# EAGLE design LIC_rack_OV-01 (EAGLE 5.06)
AUTHOR: M. Petrilak; VERSION: 01

## Sheet 1 of 2
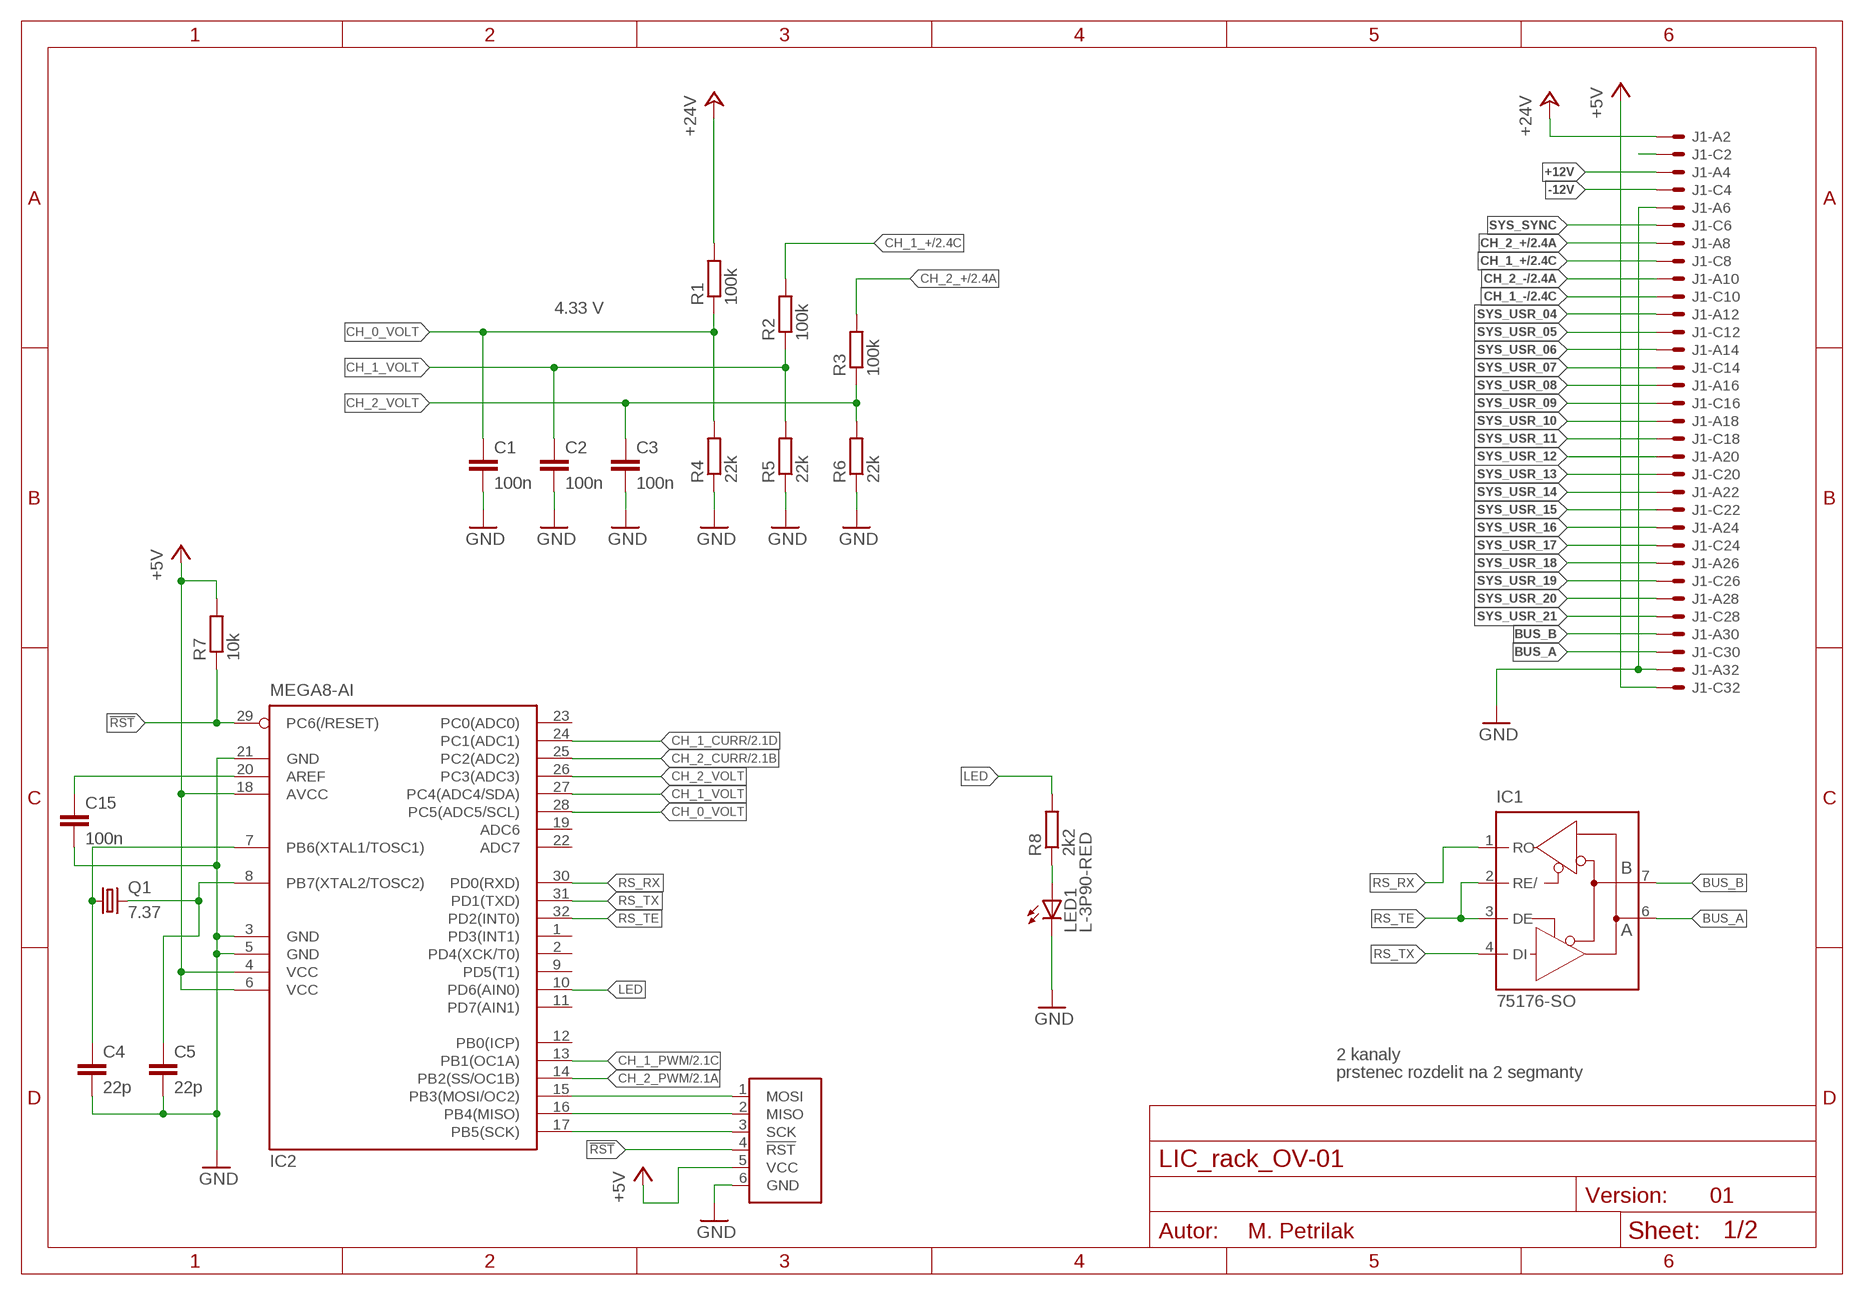
[diagram p0: schematic, sheet 1]

### Parts
C1  100n  C-EUC1206  [C1206]
C2  100n  C-EUC1206  [C1206]
C3  100n  C-EUC1206  [C1206]
C4  22p  C-EUC0805  [C0805]
C5  22p  C-EUC0805  [C0805]
C15  100n  C-EUC1206  [C1206]
IC1  75176-SO  [SO08]
IC2  MEGA8-AI  [TQFP32-08]
J1  VG32SP  [VG32P]
LED1  L-3P90-RED  [L-3P90]
Q1  7.37  XTAL  [HC49U70]
R1  100k  R-EU_R1206  [R1206]
R2  100k  R-EU_R1206  [R1206]
R3  100k  R-EU_R1206  [R1206]
R4  22k  R-EU_R1206  [R1206]
R5  22k  R-EU_R1206  [R1206]
R6  22k  R-EU_R1206  [R1206]
R7  10k  R-EU_R1206  [R1206]
R8  2k2  R-EU_R1206  [R1206]
U1  ATPROG-V  [6410-06]

### Nets
!RST: IC2.29(PC6(/RESET)) R7.1 U1.4(!RST)
+5V: IC2.4(VCC) IC2.6(VCC) IC2.18(AVCC) J1.C32 R7.2 U1.5(VCC) ; also sheet 2
+12V: J1.A4
+24V: J1.A2 R1.2 ; also sheet 2
-12V: J1.C4
BUS_A: IC1.6(A) J1.C30
BUS_B: IC1.7(B) J1.A30
CH_0_VOLT: C1.1 IC2.28(PC5(ADC5/SCL)) R1.1 R4.2
CH_1_+: J1.C8 R2.2 ; also sheet 2
CH_1_-: J1.C10 ; also sheet 2
CH_1_CURR: IC2.24(PC1(ADC1)) ; also sheet 2
CH_1_PWM: IC2.13(PB1(OC1A)) ; also sheet 2
CH_1_VOLT: C2.1 IC2.27(PC4(ADC4/SDA)) R2.1 R5.2
CH_2_+: J1.A8 R3.2 ; also sheet 2
CH_2_-: J1.A10 ; also sheet 2
CH_2_CURR: IC2.25(PC2(ADC2)) ; also sheet 2
CH_2_PWM: IC2.14(PB2(SS/OC1B)) ; also sheet 2
CH_2_VOLT: C3.1 IC2.26(PC3(ADC3)) R3.1 R6.2
GND: C1.2 C2.2 C3.2 C4.2 C5.2 C15.2 IC2.3(GND) IC2.5(GND) IC2.21(GND) J1.A6 J1.A32 LED1.K(C) R4.1 R5.1 R6.1 U1.6(GND) ; also sheet 2
LED: IC2.10(PD6(AIN0)) R8.2
N$1: IC2.17(PB5(SCK)) U1.3(SCK)
N$2: IC2.16(PB4(MISO)) U1.2(MISO)
N$3: IC2.15(PB3(MOSI/OC2)) U1.1(MOSI)
N$4: LED1.A R8.1
N$5: C4.1 IC2.7(PB6(XTAL1/TOSC1)) Q1.1
N$6: C5.1 IC2.8(PB7(XTAL2/TOSC2)) Q1.2
N$7: J1.C2
N$19: C15.1 IC2.20(AREF)
RS_RX: IC1.1(RO) IC2.30(PD0(RXD))
RS_TE: IC1.2(RE/) IC1.3(DE) IC2.32(PD2(INT0))
RS_TX: IC1.4(DI) IC2.31(PD1(TXD))
SYS_SYNC: J1.C6
SYS_USR_04: J1.A12
SYS_USR_05: J1.C12
SYS_USR_06: J1.A14
SYS_USR_07: J1.C14
SYS_USR_08: J1.A16
SYS_USR_09: J1.C16
SYS_USR_10: J1.A18
SYS_USR_11: J1.C18
SYS_USR_12: J1.A20
SYS_USR_13: J1.C20
SYS_USR_14: J1.A22
SYS_USR_15: J1.C22
SYS_USR_16: J1.A24
SYS_USR_17: J1.C24
SYS_USR_18: J1.A26
SYS_USR_19: J1.C26
SYS_USR_20: J1.A28
SYS_USR_21: J1.C28
Unconnected: IC2.1(PD3(INT1)) IC2.2(PD4(XCK/T0)) IC2.9(PD5(T1)) IC2.11(PD7(AIN1)) IC2.12(PB0(ICP)) IC2.19(ADC6) IC2.22(ADC7) IC2.23(PC0(ADC0))

### Notes on the sheet
- 4.33 V
- 2 kanaly
- prstenec rozdelit na 2 segmanty

## Sheet 2 of 2
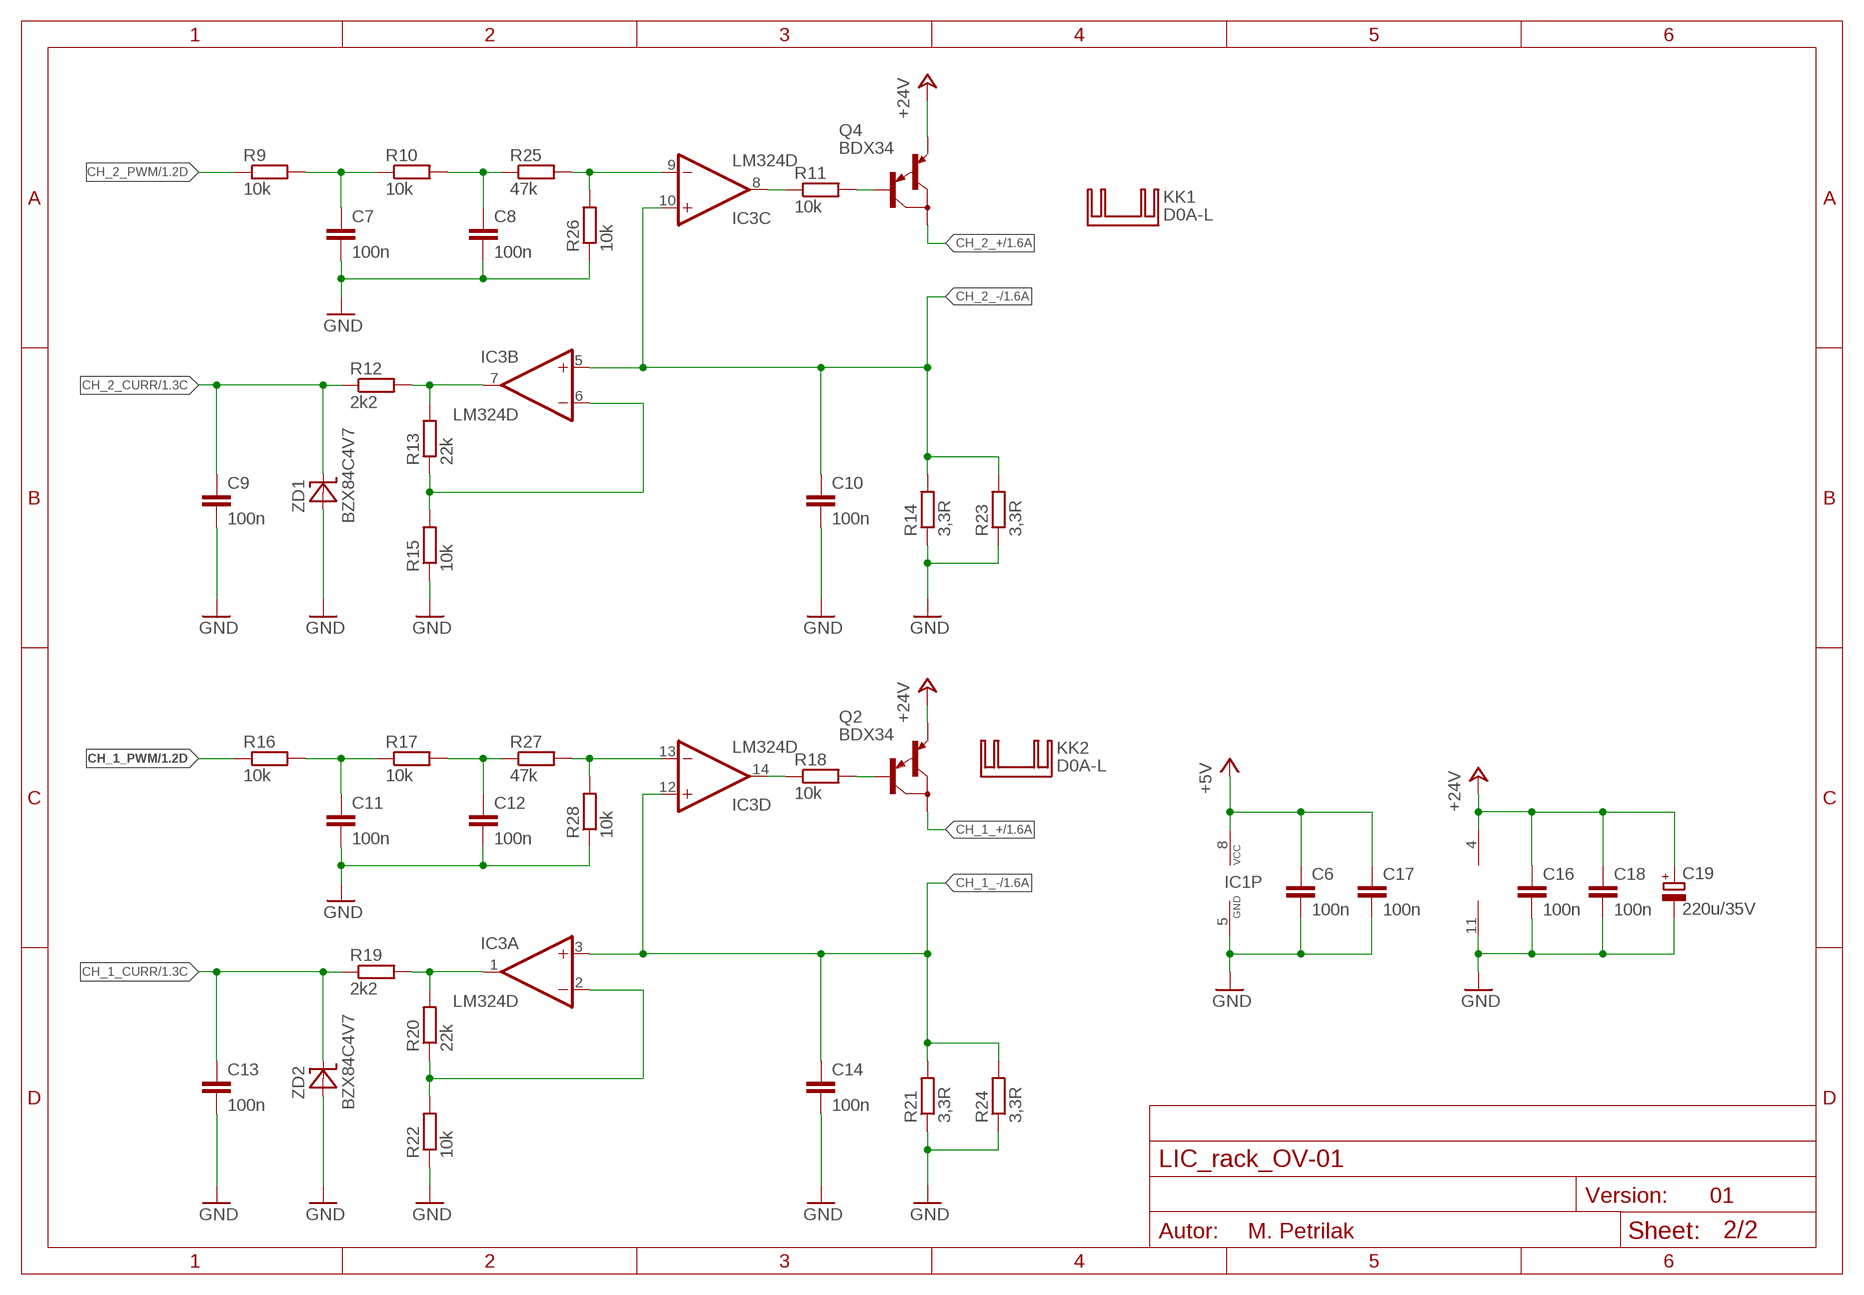
[diagram p1: schematic, sheet 2]

### Parts
C6  100n  C-EUC1206  [C1206]
C7  100n  C-EUC1206  [C1206]
C8  100n  C-EUC1206  [C1206]
C9  100n  C-EUC1206  [C1206]
C10  100n  C-EUC1206  [C1206]
C11  100n  C-EUC1206  [C1206]
C12  100n  C-EUC1206  [C1206]
C13  100n  C-EUC1206  [C1206]
C14  100n  C-EUC1206  [C1206]
C16  100n  C-EUC1206  [C1206]
C17  100n  C-EUC1206  [C1206]
C18  100n  C-EUC1206  [C1206]
C19  220u/35V  CPOL-EUE3.5-8L  [E3,5-8L]
IC3  LM324D  [SO14]
KK1  D0A-L  [D02A-L]
KK2  D0A-L  [D02A-L]
Q2  BDX34  [TO220]
Q4  BDX34  [TO220]
R9  10k  R-EU_R1206  [R1206]
R10  10k  R-EU_R1206  [R1206]
R11  10k  R-EU_R1206  [R1206]
R12  2k2  R-EU_R1206  [R1206]
R13  22k  R-EU_R1206  [R1206]
R14  3,3R  R-EU_0309/12  [0309/12]
R15  10k  R-EU_R1206  [R1206]
R16  10k  R-EU_R1206  [R1206]
R17  10k  R-EU_R1206  [R1206]
R18  10k  R-EU_R1206  [R1206]
R19  2k2  R-EU_R1206  [R1206]
R20  22k  R-EU_R1206  [R1206]
R21  3,3R  R-EU_0309/12  [0309/12]
R22  10k  R-EU_R1206  [R1206]
R23  3,3R  R-EU_R1206  [R1206]
R24  3,3R  R-EU_R1206  [R1206]
R25  47k  R-EU_R1206  [R1206]
R26  10k  R-EU_R1206  [R1206]
R27  47k  R-EU_R1206  [R1206]
R28  10k  R-EU_R1206  [R1206]
ZD1  BZX84C4V7  [SOT23]
ZD2  BZX84C4V7  [SOT23]

### Nets
+5V: C6.1 C17.1 IC1.8(VCC) ; also sheet 1
+24V: C16.1 C18.1 C19.+ IC3.4(P:V+) Q2.3(E) Q4.3(E) ; also sheet 1
CH_1_+: Q2.2(C) ; also sheet 1
CH_1_-: C14.1 IC3.3(A:+IN) IC3.12(D:+IN) R21.2 R24.2 ; also sheet 1
CH_1_CURR: C13.1 R19.1 ZD2.3(C) ; also sheet 1
CH_1_PWM: R16.1 ; also sheet 1
CH_2_+: Q4.2(C) ; also sheet 1
CH_2_-: C10.1 IC3.5(B:+IN) IC3.10(C:+IN) R14.2 R23.2 ; also sheet 1
CH_2_CURR: C9.1 R12.1 ZD1.3(C) ; also sheet 1
CH_2_PWM: R9.1 ; also sheet 1
GND: C6.2 C7.2 C8.2 C9.2 C10.2 C11.2 C12.2 C13.2 C14.2 C16.2 C17.2 C18.2 C19.- IC1.5(GND) IC3.11(P:V-) R14.1 R15.1 R21.1 R22.1 R23.1 R24.1 R26.1 R28.1 ZD1.1(A) ZD2.1(A) ; also sheet 1
N$8: IC3.2(A:-IN) R20.1 R22.2
N$9: C11.1 R16.2 R17.1
N$10: C12.1 R17.2 R27.1
N$11: C7.1 R9.2 R10.1
N$12: C8.1 R10.2 R25.1
N$13: IC3.6(B:-IN) R13.1 R15.2
N$14: IC3.8(C:OUT) R11.1
N$15: Q4.1(B) R11.2
N$16: IC3.14(D:OUT) R18.1
N$17: Q2.1(B) R18.2
N$18: IC3.1(A:OUT) R19.2 R20.2
N$20: IC3.7(B:OUT) R12.2 R13.2
N$21: IC3.9(C:-IN) R25.2 R26.2
N$22: IC3.13(D:-IN) R27.2 R28.2

## Library data of the parts
C1-C18 = rcl:C-EU: CAPACITOR, European symbol
C19 = rcl:CPOL-EU: POLARIZED CAPACITOR, European symbol
IC1 = maxim:75176
IC2 = atmel:MEGA8: MICROCONTROLLER 8 Kbytes FLASH, 1 kbytes SRAM, 512 bytes EEPROM, USART, 6-channel 10 bit ADC, 2-channel 8 bit ADC Pin compatible with Atmega48, ATMega88, ATMega168 Source: avr.lbr
IC3 = linear:LM324: OP AMP
J1 = 19inch:VG32S: PCB EUROCARD, 32-pin type C/AC, 5.08 mm
KK1 KK2 = heatsink:D0A-L: HEATSINK distributor Schukat
LED1 = led:L-3P90
Q1 = crystal:XTAL
Q2 Q4 = transistor-pnp:BDX34: PNP Darlington Transistor
R1-R28 = rcl:R-EU_: RESISTOR, European symbol
U1 = con-molex:ATPROG
ZD1 ZD2 = diode:BZX84C*

## Net classes
1 PC: clearance 2 mm to class 0

## Board
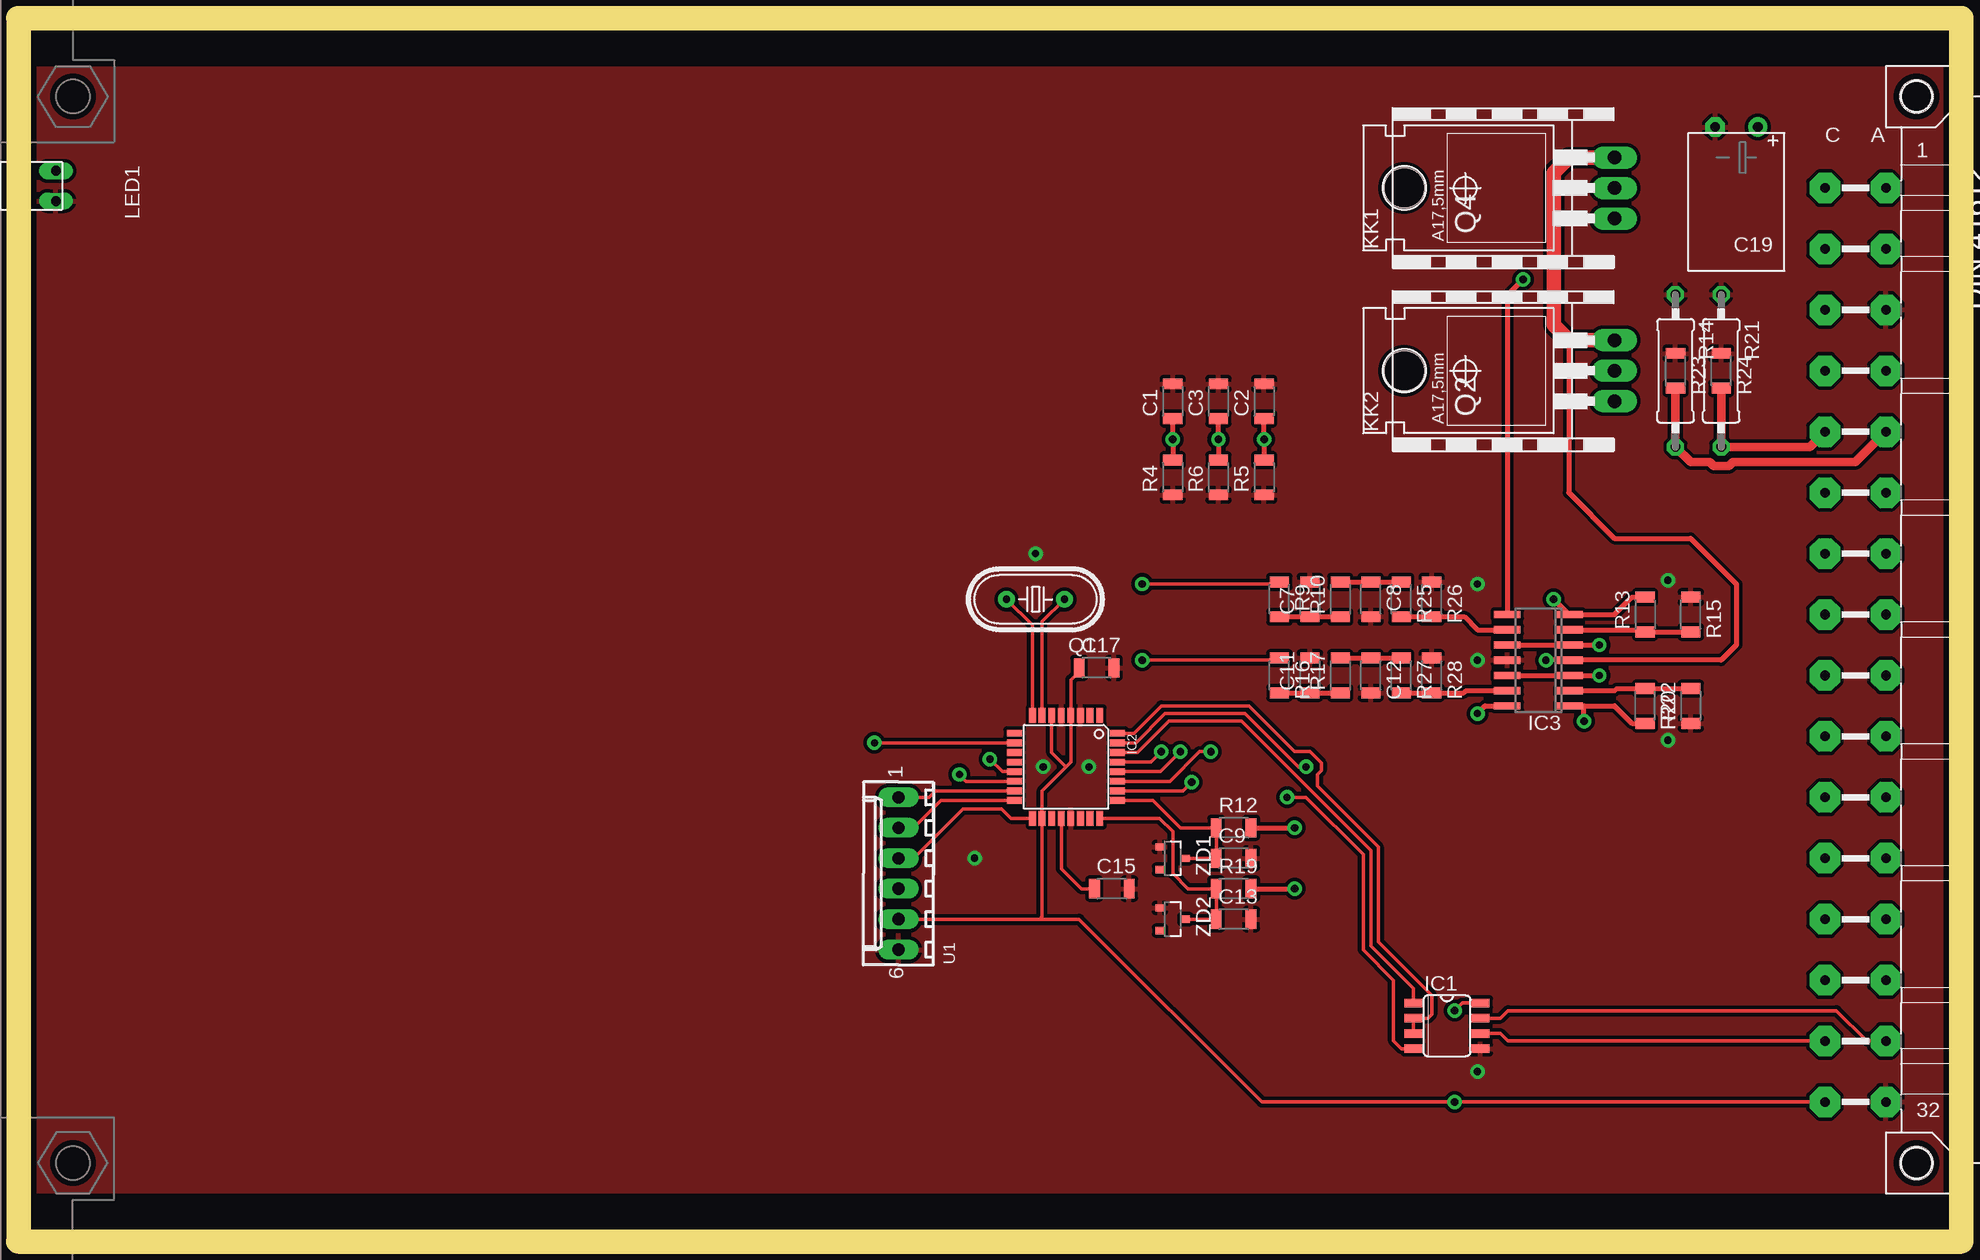
[diagram p2: board, top side]
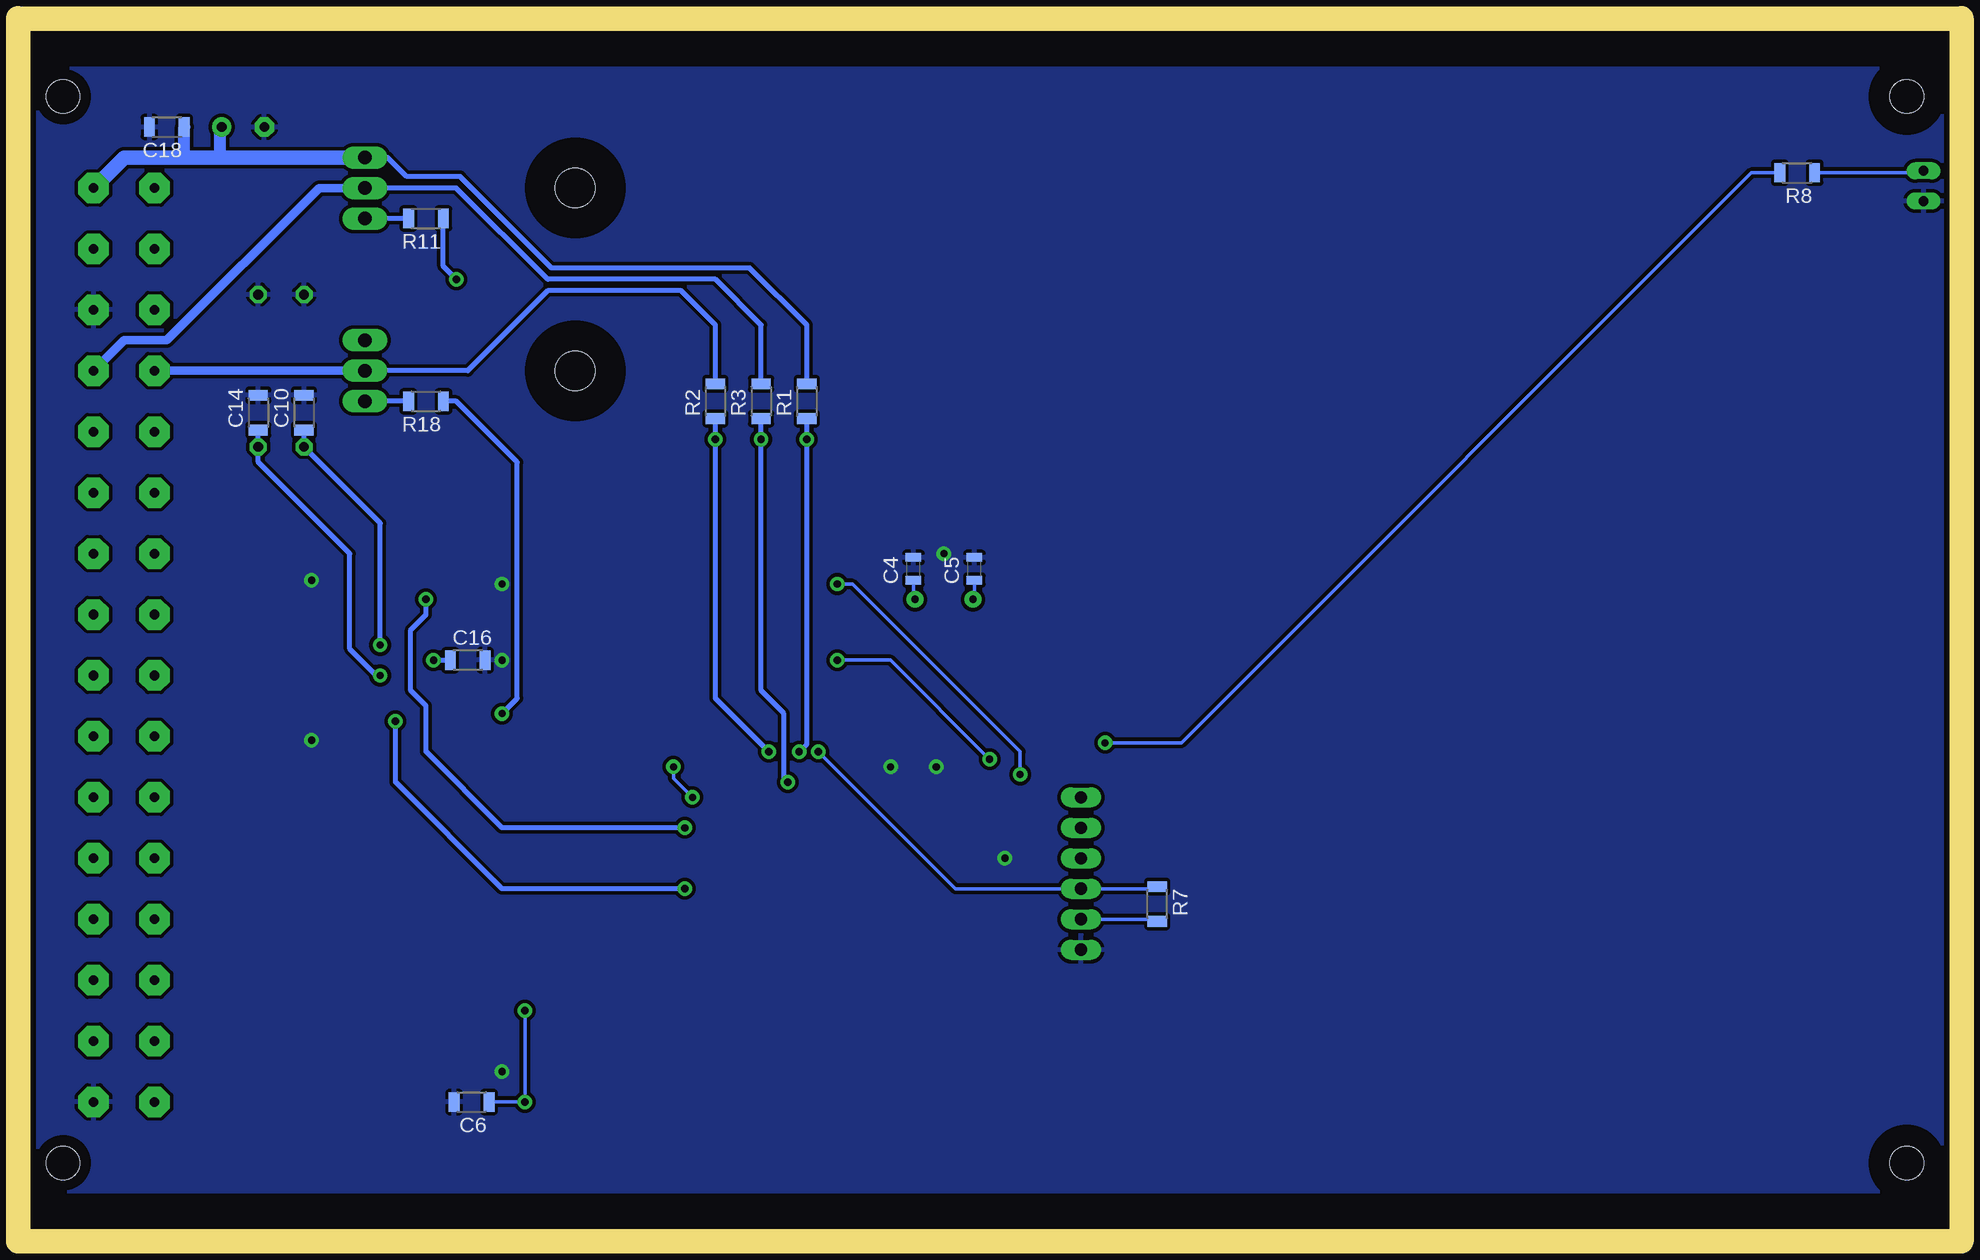
[diagram p3: board, bottom side, seen from below]

Size 160 x 100 mm. Coordinates in mm from the lower left corner, seen from the top.
Copper layers (1*16): Top 0.04mm / dielectric 1.5mm / Bottom 0.04mm
Design rules "mucha_navrh *": minimum track width 0.2mm, minimum drill 0.6mm, track to track 0.3mm, track to pad 0.3mm, pad to pad 0.3mm, via to via 0.3mm, smd to smd 0mil, copper to edge 0.5mm, drill to drill 0.5mm, minimum pad ring 0.3mm, minimum via ring 0.3mm, stop-mask expansion 0.1mm, vias tented up to drill 1mm, thermal gap 0.3mm

### Footprints (pad centres in the part's own frame; a part is rotated, then mirrored left to right if it is on the bottom)
C1206 = smd 0.9 x 1.6: 1 -1.45,0; 2 1.45,0
C0805 = smd 0.7 x 1.3: 1 -0.95,0; 2 0.95,0
E3,5-8L = drill 0.813 pad 1.6 round: + -1.778,0 | drill 0.813 pad 1.6 octagon: - 1.778,0
SO08 = smd 0.72 x 1.5: 1 -1.905,-2.8; 2 -0.635,-2.8; 3 0.635,-2.8; 4 1.905,-2.8; 5 1.905,2.8; 6 0.635,2.8; 7 -0.635,2.8; 8 -1.905,2.8
TQFP32-08 = smd 1.27 x 0.559: 1 -4.293,2.8; 2 -4.293,2; 3 -4.293,1.2; 4 -4.293,0.4; 5 -4.293,-0.4; 6 -4.293,-1.2; 7 -4.293,-2; 8 -4.293,-2.8; 17 4.293,-2.8; 18 4.293,-2; 19 4.293,-1.2; 20 4.293,-0.4; 21 4.293,0.4; 22 4.293,1.2; 23 4.293,2; 24 4.293,2.8 | smd 0.559 x 1.27: 9 -2.8,-4.293; 10 -2,-4.293; 11 -1.2,-4.293; 12 -0.4,-4.293; 13 0.4,-4.293; 14 1.2,-4.293; 15 2,-4.293; 16 2.8,-4.293; 25 2.8,4.293; 26 2,4.293; 27 1.2,4.293; 28 0.4,4.293; 29 -0.4,4.293; 30 -1.2,4.293; 31 -2,4.293; 32 -2.8,4.293
SO14 = smd 0.6 x 2.2: 1 -3.81,-2.6; 2 -2.54,-2.6; 3 -1.27,-2.6; 4 0,-2.6; 5 1.27,-2.6; 6 2.54,-2.6; 7 3.81,-2.6; 8 3.81,2.6; 9 2.54,2.6; 10 1.27,2.6; 11 0,2.6; 12 -1.27,2.6; 13 -2.54,2.6; 14 -3.81,2.6
VG32P = drill 0.8 pad 2.54 octagon: A2 154.7,36.83; A4 154.7,31.75; A6 154.7,26.67; A8 154.7,21.59; A10 154.7,16.51; A12 154.7,11.43; A14 154.7,6.35; A16 154.7,1.27; A18 154.7,-3.81; A20 154.7,-8.89; A22 154.7,-13.97; A24 154.7,-19.05; A26 154.7,-24.13; A28 154.7,-29.21; A30 154.7,-34.29; A32 154.7,-39.37; C2 149.62,36.83; C4 149.62,31.75; C6 149.62,26.67; C8 149.62,21.59; C10 149.62,16.51; C12 149.62,11.43; C14 149.62,6.35; C16 149.62,1.27; C18 149.62,-3.81; C20 149.62,-8.89; C22 149.62,-13.97; C24 149.62,-19.05; C26 149.62,-24.13; C28 149.62,-29.21; C30 149.62,-34.29; C32 149.62,-39.37 | hole 2.794: 3.57,44.45; 3.57,-44.45; 157.24,44.45; 157.24,-44.45; 3.57,44.45; 3.57,-44.45; 157.24,44.45; 157.24,-44.45
L-3P90 = drill 0.813 long: A 4.7,1.27; K 4.7,-1.27
HC49U70 = drill 0.6 pad 1.4 round: 1 -2.413,0; 2 2.413,0
TO220 = drill 1.118 long: 1 -2.54,-6.35; 2 0,-6.35; 3 2.54,-6.35 | hole 3.302: 0,11.176
R1206 = smd 0.9 x 1.6: 1 -1.45,0; 2 1.45,0
0309/12 = drill 0.813 octagon: 1 -6.35,0; 2 6.35,0
6410-06 = drill 1.016 long: 1 6.35,0; 2 3.81,0; 3 1.27,0; 4 -1.27,0; 5 -3.81,0; 6 -6.35,0
SOT23 = smd 0.6 x 0.8: 1 -0.95,-1.05; 2 0.95,-1.05; 3 0,1.05

### Placement (x,y rotation side)
C1  95.25,69.05 90 top
C2  102.87,69.05 90 top
C3  99.06,69.05 90 top
C4  86.36,55.08 90 bottom
C5  81.28,55.08 90 bottom
C6  123.19,10.63 180 bottom
C7  106.68,52.54 90 top
C8  111.76,52.54 270 top
C9  100.33,30.95 0 top
C10  137.16,68.1 90 bottom
C11  106.68,46.19 90 top
C12  111.76,46.19 270 top
C13  100.33,25.87 0 top
C14  140.97,68.1 90 bottom
C15  90.17,28.41 0 top
C16  123.51,47.46 0 bottom
C17  88.9,46.83 0 top
C18  148.59,91.91 180 bottom
C19  142.24,91.91 180 top
IC1  118.11,16.98 270 top
IC2  86.36,38.57 270 top
IC3  125.73,47.46 90 top
J1  0,50 0 top
KK1  125.73,86.83 0 top
KK2  125.73,71.59 0 top
LED1  -2.54,87 0 top
Q1  83.82,52.54 180 top
Q2  125.73,71.59 90 top
Q4  125.73,86.83 90 top
R1  95.25,69.05 90 bottom
R2  102.87,69.05 90 bottom
R3  99.06,69.05 90 bottom
R4  95.25,62.7 90 top
R5  102.87,62.7 90 top
R6  99.06,62.7 90 top
R7  66.04,27.14 270 bottom
R8  12.7,88.1 180 bottom
R9  104.14,52.54 270 top
R10  109.22,52.54 90 top
R11  127,84.29 180 bottom
R12  100.33,33.49 0 top
R13  134.62,51.27 90 top
R14  137.16,71.59 270 top
R15  138.43,51.27 270 top
R16  104.14,46.19 270 top
R17  109.22,46.19 90 top
R18  127,69.05 180 bottom
R19  100.33,28.41 0 top
R20  134.62,43.65 270 top
R21  140.97,71.59 270 top
R22  138.43,43.65 90 top
R23  137.16,71.59 270 top
R24  140.97,71.59 270 top
R25  114.3,52.54 270 top
R26  116.84,52.54 270 top
R27  114.3,46.19 270 top
R28  116.84,46.19 270 top
U1  72.39,29.68 90 top
ZD1  95.25,30.95 270 top
ZD2  95.25,25.87 270 top

### Tracks (layer width: path | path; a pad name or v marks a point on that pad's centre or on a via)
!RST  (via drill 0.6)
  Top 0.305: IC2.29 93.43,38.97 v94.3,39.84
  Bottom 0.305: R7.1 66.22,28.41 U1.4 82.87,28.41 v94.3,39.84
+5V  (via drill 0.6)
  Top 0.305: IC2.6 85.16,39.77 86.36,38.57 | 86.36,38.57 86.76,38.97 IC2.4 86.76,45.82 87.45,46.51 C17.1 | 86.36,38.57 84.36,36.57 IC2.18 84.36,26.09 84.14,25.87 | J1.C32 v118.75,10.63 102.68,10.63 87.44,25.87 84.14,25.87 | IC1.8 119.38,18.89 v118.75,18.25 | U1.5 84.14,25.87
  Bottom 0.305: U1.5 66.22,25.87 R7.2 | v118.75,18.25 v118.75,10.63 C6.1
+24V  (via drill 0.6)
  Top 0.406: 128.27,74.13 128.27,61.43 132.08,57.62 138.43,57.62 142.24,53.81 142.24,48.73 140.97,47.46 IC3.4 v126.36,47.46
  Top 1.2: Q4.3 128.27,89.37 127,88.1 127,75.4 128.27,74.13 Q2.3
  Bottom 0.406: v126.36,47.46 C16.1 | R1.2 95.25,75.4 100.01,80.16 116.52,80.16 124.14,87.78 128.59,87.78 130.18,89.37 Q4.3
  Bottom 1: C19.+ 144.15,91.91 144.15,89.37 | 147.14,89.37 C18.1
  Bottom 1.2: Q4.3 144.15,89.37 147.14,89.37 152.16,89.37 J1.A2
BUS_A
  Top 0.305: IC1.6 122.56,16.34 123.19,15.71 J1.C30
BUS_B
  Top 0.305: J1.A30 153.11,15.71 150.57,18.25 123.19,18.25 122.56,17.62 IC1.7
CH_0_VOLT  (via drill 0.6)
  Top 0.305: IC2.28 94.22,38.17 v95.89,39.84
  Top 0.406: C1.1 v95.25,65.88 R4.2
  Bottom 0.406: C1.1 v95.25,65.88 95.25,40.48 v95.89,39.84
CH_1_+
  Bottom 0.406: Q2.2 123.51,71.59 116.84,78.26 105.73,78.26 102.87,75.4 R2.2
  Bottom 0.7: Q2.2 J1.C8
CH_1_-  (via drill 0.6)
  Top 0.406: IC3.12 IC3.3 v130.81,46.19
  Top 0.7: J1.C10 148.35,65.24 R21.2 R24.2
  Bottom 0.406: C14.1 R21.2 140.97,63.97 133.35,56.35 133.35,48.41 131.13,46.19 v130.81,46.19
CH_1_CURR
  Top 0.305: ZD2.3 C13.1 R19.1 96.52,28.41 95.25,29.68 95.25,33.17 94.14,34.28 IC2.24
CH_1_PWM  (via drill 0.6)
  Top 0.305: IC2.13 81.05,38.17 v80.01,39.2 | R16.1 103.96,47.46 v92.71,47.46
  Bottom 0.305: v92.71,47.46 88.27,47.46 v80.01,39.2
CH_1_VOLT  (via drill 0.6)
  Top 0.305: IC2.27 95,37.37 97.47,39.84 v98.42,39.84
  Top 0.406: C2.1 v102.87,65.88 R5.2
  Bottom 0.406: C2.1 v102.87,65.88 102.87,44.28 v98.42,39.84
CH_2_+
  Bottom 0.406: Q4.2 124.46,86.83 116.84,79.21 102.87,79.21 99.06,75.4 R3.2
  Bottom 0.7: Q4.2 135.89,86.83 148.59,74.13 152.16,74.13 J1.A8
CH_2_-  (via drill 0.6)
  Top 0.406: IC3.10 IC3.5 v130.81,48.73
  Top 0.7: J1.A10 152.16,63.97 141.92,63.97 141.6,63.65 140.34,63.65 140.02,63.97 138.43,63.97 R14.2 R23.2
  Bottom 0.406: C10.1 R14.2 134.94,63.02 130.81,58.89 v130.81,48.73
CH_2_CURR
  Top 0.305: ZD1.3 C9.1 R12.1 95.89,33.49 93.61,35.77 IC2.25
CH_2_PWM  (via drill 0.6)
  Top 0.305: IC2.14 78.03,37.37 v77.47,37.94 | R9.1 103.96,53.81 v92.71,53.81
  Bottom 0.305: v92.71,53.81 91.44,53.81 77.47,39.84 v77.47,37.94
CH_2_VOLT  (via drill 0.6)
  Top 0.305: IC2.26 96.11,36.57 v96.84,37.3
  Top 0.406: C3.1 v99.06,65.88 R6.2
  Bottom 0.406: C3.1 v99.06,65.88 99.06,44.92 97.16,43.02 97.16,37.62 v96.84,37.3
GND  (via drill 0.6)
  other vias: 88.27,38.57 84.45,38.57 78.74,30.95 120.65,47.46 120.65,13.17 120.65,53.81 136.53,54.13 136.53,40.79 83.82,56.35
  pour Bottom: 0,0.47 160.02,0.47 160.02,99.53 0,99.53
  pour Top: 0,0.47 160.02,0.47 160.02,99.53 0,99.53
LED  (via drill 0.6)
  Top 0.305: v70.39,40.57 IC2.10
  Bottom 0.305: R8.2 16.51,88.1 64.04,40.57 v70.39,40.57
N$1
  Top 0.305: U1.3 73.66,30.95 77.79,35.08 80.96,35.08 81.76,34.28 IC2.17
N$2
  Top 0.305: IC2.16 75.94,35.77 73.66,33.49 U1.2
N$3
  Top 0.305: IC2.15 75.47,36.57 74.93,36.03 U1.1
N$4
  Bottom 0.305: LED1.A 2.33,88.1 R8.1
N$5
  Top 0.305: IC2.7 84.36,50.67 Q1.1
  Bottom 0.305: C4.1 86.36,52.67 Q1.1
N$6
  Top 0.305: IC2.8 83.56,50.39 Q1.2
  Bottom 0.305: C5.1 81.28,52.67 Q1.2
N$8
  Top 0.406: IC3.2 132.08,44.92 132.26,45.1 R20.1 R22.2
N$9
  Top 0.406: R17.1 C11.1 R16.2
N$10
  Top 0.406: R27.1 C12.1 R17.2
N$11
  Top 0.406: R9.2 C7.1 R10.1
N$12
  Top 0.406: R10.2 C8.1 R25.1
N$13
  Top 0.406: IC3.6 134.44,50 R13.1 R15.2
N$14  (via drill 0.6)
  Top 0.406: IC3.8 123.19,51.33 123.19,77.94 v124.46,79.21
  Bottom 0.406: v124.46,79.21 125.55,80.3 R11.1
N$15
  Bottom 0.406: R11.2 Q4.1
N$16  (via drill 0.6)
  Top 0.406: IC3.14 121.28,43.65 v120.65,43.02
  Bottom 0.406: v120.65,43.02 119.38,44.28 119.38,63.97 124.46,69.05 R18.1
N$17
  Bottom 0.406: R18.2 Q2.1
N$18  (via drill 0.6)
  Top 0.406: 129.54,43.65 IC3.1 | 129.54,43.65 132.08,43.65 133.53,42.2 R20.2 | v129.54,42.38 129.54,43.65 | R19.2 v105.41,28.41
  Bottom 0.406: v105.41,28.41 120.65,28.41 129.54,37.3 v129.54,42.38
N$19
  Top 0.305: C15.1 87.63,28.41 85.96,30.08 IC2.20
N$20  (via drill 0.6)
  Top 0.406: R13.2 133.53,52.72 132.08,51.27 IC3.7 128.27,51.27 v127,52.54 | R12.2 v105.41,33.49
  Bottom 0.406: v127,52.54 127,51.27 128.27,50 128.27,44.92 127,43.65 127,39.84 120.65,33.49 v105.41,33.49
N$21
  Top 0.406: R25.2 R26.2 119.56,51.09 120.65,50 IC3.9
N$22
  Top 0.406: R27.2 R28.2 119.52,44.74 119.7,44.92 IC3.13
RS_RX
  Top 0.305: IC2.30 92.32,39.77 94.93,42.38 100.97,42.38 111.76,31.59 111.76,23.65 115.31,20.1 IC1.1
RS_TE
  Top 0.305: IC1.3 IC1.2 116.52,17.62 116.84,17.93 116.84,19.52 112.39,23.96 112.39,31.9 107.31,36.98 107.31,37.94 107.63,38.25 107.63,38.89 106.68,39.84 105.41,39.84 101.6,43.65 94.3,43.65 92.02,41.37 IC2.32
RS_TX  (via drill 0.6)
  Top 0.305: IC2.31 92.17,40.57 94.61,43.02 101.28,43.02 105.73,38.57 v106.36,38.57 | IC1.4 114.3,15.08 113.67,15.71 113.67,20.79 111.12,23.33 111.12,31.27 106.36,36.03 v104.78,36.03
  Bottom 0.305: v106.36,38.57 106.36,37.62 v104.78,36.03